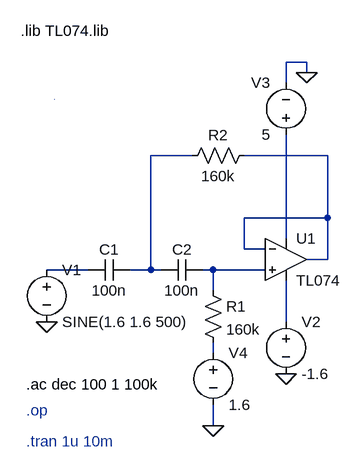
[diagram p0: schematic hpf.asc]
hpf.asc, the LTspice schematic file:
Version 4
SHEET 1 880 1672
WIRE 288 1072 256 1072
WIRE 288 1088 288 1072
WIRE 256 1104 256 1072
WIRE 112 1216 48 1216
WIRE 320 1216 192 1216
WIRE 320 1312 320 1216
WIRE 320 1312 192 1312
WIRE 256 1344 256 1184
WIRE 192 1360 192 1312
WIRE 224 1360 192 1360
WIRE 320 1376 320 1312
WIRE 320 1376 288 1376
WIRE -48 1392 -112 1392
WIRE 48 1392 48 1216
WIRE 48 1392 16 1392
WIRE 64 1392 48 1392
WIRE 144 1392 128 1392
WIRE 224 1392 144 1392
WIRE 144 1424 144 1392
WIRE 256 1472 256 1408
WIRE 144 1520 144 1504
WIRE 144 1632 144 1600
FLAG -112 1472 0
FLAG 288 1088 0
FLAG 256 1552 0
FLAG 144 1632 0
SYMBOL cap 16 1376 R90
WINDOW 0 0 32 VBottom 2
WINDOW 3 32 32 VTop 2
SYMATTR InstName C1
SYMATTR Value 100n
SYMATTR SpiceLine Lser=0 mfg="   ---" pn="   ---" type="   ---"
SYMBOL cap 128 1376 R90
WINDOW 0 0 32 VBottom 2
WINDOW 3 32 32 VTop 2
SYMATTR InstName C2
SYMATTR Value 100n
SYMATTR SpiceLine Lser=408p mfg="   ---" pn="   ---" type="   ---"
SYMBOL Res 128 1408 R0
SYMATTR InstName R1
SYMATTR Value 160k
SYMBOL Res 208 1200 R90
WINDOW 0 0 56 VBottom 2
WINDOW 3 32 56 VTop 2
SYMATTR InstName R2
SYMATTR Value 160k
SYMBOL voltage -112 1376 R0
SYMATTR InstName V1
SYMATTR Value SINE(1.6 1.6 500)
SYMATTR Value2 AC 1.6
SYMBOL voltage 256 1200 R180
WINDOW 0 24 96 Left 2
WINDOW 3 24 16 Left 2
SYMATTR InstName V3
SYMATTR Value 5
SYMBOL voltage 256 1456 R0
SYMATTR InstName V2
SYMATTR Value -1.6
SYMBOL OpAmps/opamp2 256 1312 R0
SYMATTR InstName U1
SYMATTR Value TL074
SYMBOL voltage 144 1504 R0
SYMATTR InstName V4
SYMATTR Value 1.6
TEXT -144 1568 Left 2 !.ac dec 100 1 100k
TEXT -144 1608 Left 2 ;.op
TEXT -144 1656 Left 2 ;.tran 1u 10m
TEXT -152 1024 Left 2 !.lib TL074.lib
ARC Normal -100 1140 -108 1120 180 1096 76 1088 2

The netlist it stands for:
* hpf.asc
C1 N001 N004 100n Lser=0 mfg="   ---" pn="   ---" type="   ---"
C2 N005 N001 100n Lser=408p mfg="   ---" pn="   ---" type="   ---"
R1 N005 N007 160k
R2 N002 N001 160k
V1 N004 0 SINE(1.6 1.6 500) AC 1.6
V3 N003 0 5
V2 N006 0 -1.6
XU1 N005 N002 N003 N006 N002 TL074  ; pins In+ In- V+ V- OUT
V4 N007 0 1.6
.ac dec 100 1 100k
* .op
* .tran 1u 10m
.lib TL074.lib
.backanno
.end